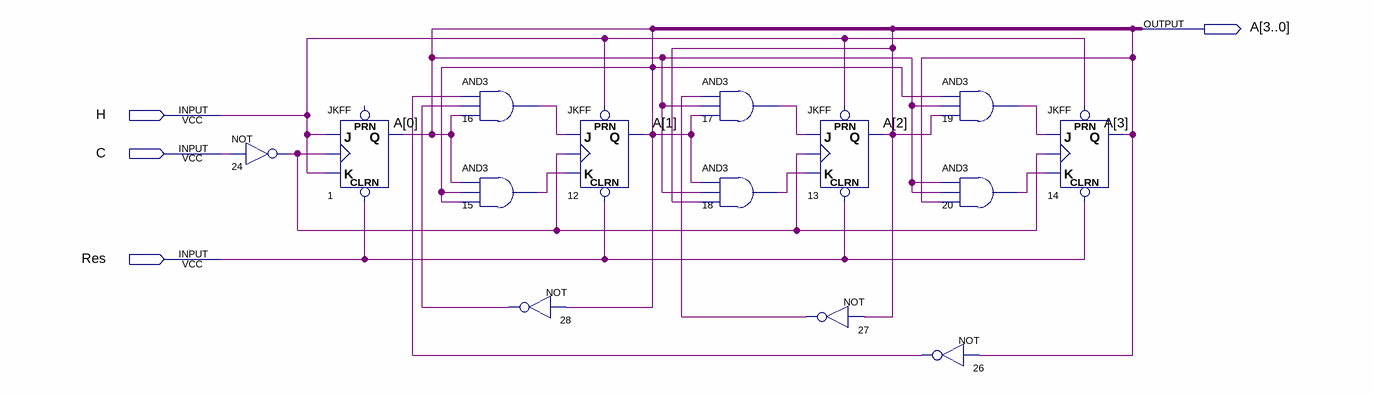
[diagram p0: schematic sheet]
// Quartus schematic szaehler_01.bdf as structural Verilog: 14 symbols, 4 pins
module szaehler_01 (
  input  H,
  input  C,
  input  Res,
  output [3:0] A
);

  wire n15_out, n16_out, n17_out, n18_out, n19_out, n20_out, n24_out, n26_out, n27_out, n28_out;

  not u_24 (n24_out, C);
  JKFF u_1 (.CLRN(Res), .K(H), .J(H), .CLK(n24_out), .Q(A[0]));  // open: PRN
  and u_16 (n16_out, n26_out, n28_out, A[0]);
  and u_15 (n15_out, A[0], A[1], A[1]);
  not u_28 (n28_out, A[1]);
  JKFF u_12 (.PRN(H), .CLRN(Res), .K(n15_out), .J(n16_out), .CLK(n24_out), .Q(A[1]));
  and u_17 (n17_out, n27_out, A[0], A[1]);
  and u_18 (n18_out, A[1], A[0], A[2]);
  JKFF u_13 (.PRN(H), .CLRN(Res), .K(n18_out), .J(n17_out), .CLK(n24_out), .Q(A[2]));
  not u_27 (n27_out, A[2]);
  and u_19 (n19_out, A[1], A[0], A[2]);
  and u_20 (n20_out, A[0], A[0], A[3]);
  not u_26 (n26_out, A[3]);
  JKFF u_14 (.PRN(H), .CLRN(Res), .K(n20_out), .J(n19_out), .CLK(n24_out), .Q(A[3]));
endmodule
